# EAGLE schematic Conexión_Sensores (EAGLE 8.0.1)
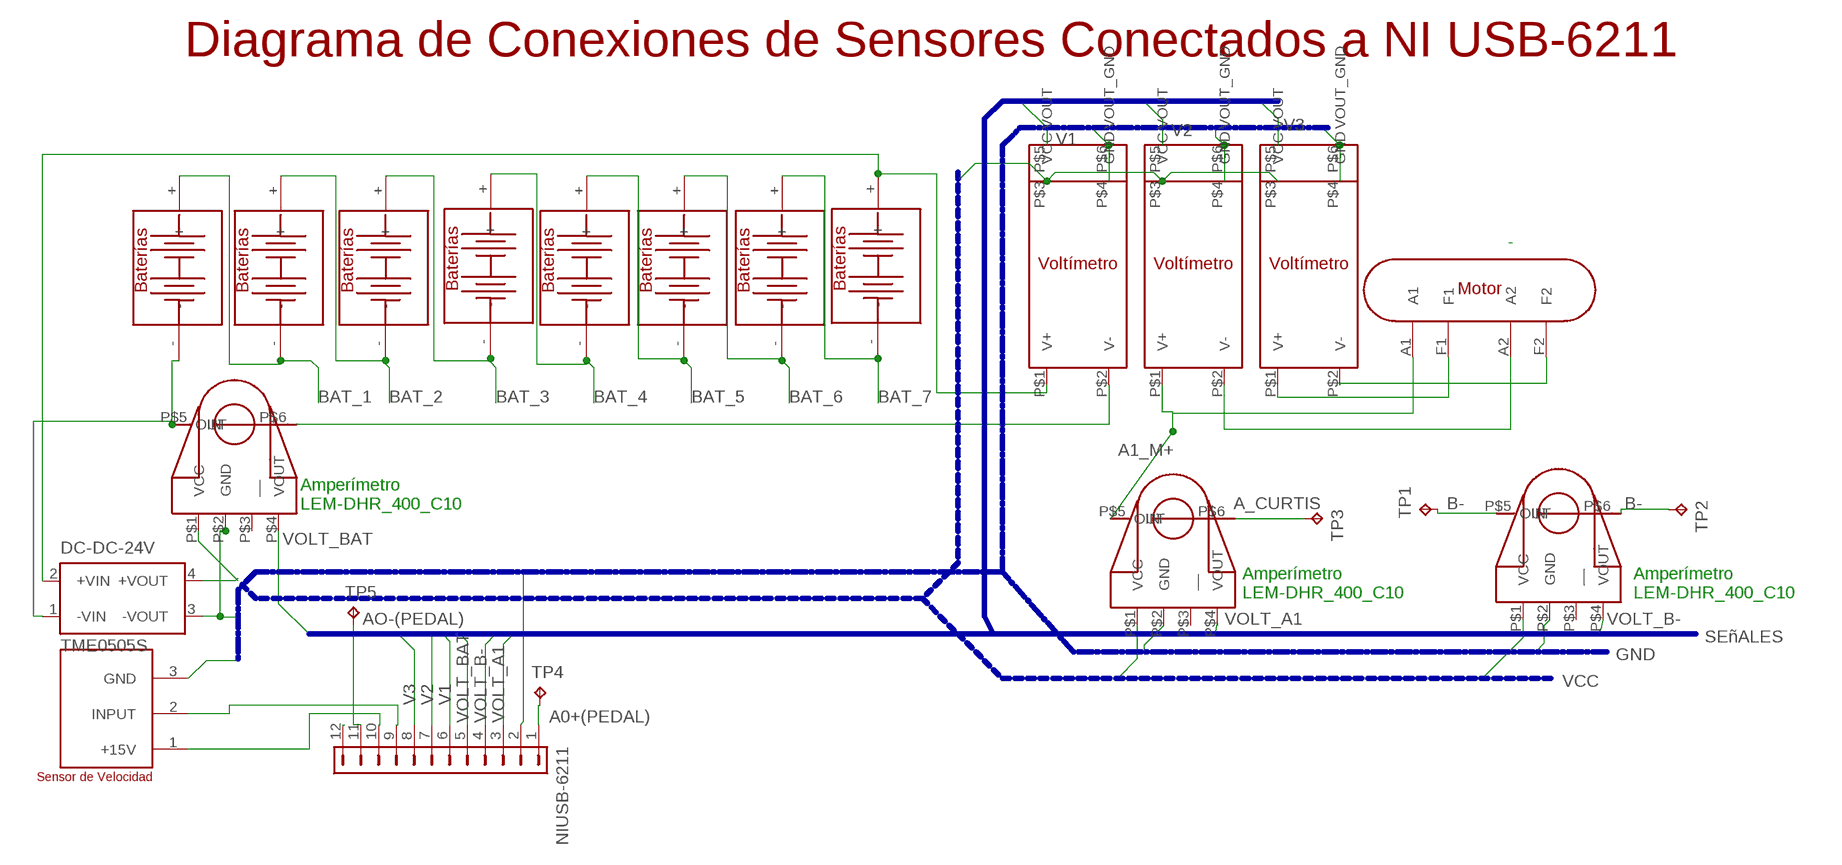
[diagram p0: schematic, sheet 1]

## Parts
AMPERIMETRO_1  AMPERIMETRO  [AMPERIMETRO]
AMPERIMETRO_2  AMPERIMETRO  [AMPERIMETRO]
DC-DC-24V  TME0505S  [TME]
NIUSB-6211  FH21-12S-1DSA  [FH21-12S-1DSA]
TP1  TPPAD1-13  [P1-13]
TP2  TPPAD1-13  [P1-13]
TP3  TPPAD1-13  [P1-13]
TP4  TPPAD1-13  [P1-13]
TP5  TPPAD1-13  [P1-13]
U$1  AMPERIMETRO  [AMPERIMETRO]
U$2  BATERIA  [BATERIA]
U$3  BATERIA  [BATERIA]
U$4  MOTOR_SENSORES  [MOTOR_SENSORES]
U$5  SENSOR_VELOCIDAD  [SENSOR_VEL]
U$6  BATERIA  [BATERIA]
U$7  BATERIA  [BATERIA]
U$8  BATERIA  [BATERIA]
U$9  BATERIA  [BATERIA]
U$10  BATERIA  [BATERIA]
U$11  BATERIA  [BATERIA]
V1  VOLTIMETRO  [VOLTIMETRO]
V2  VOLTIMETRO  [VOLTIMETRO]
V3  VOLTIMETRO  [VOLTIMETRO]

## Nets
A0+(PEDAL): NIUSB-6211.1 TP4.TP
A1_M+: AMPERIMETRO_1.P$5(IN) U$4.A1 V2.P$1(V+)
A_CURTIS: AMPERIMETRO_1.P$6(OUT) TP3.TP
AO-(PEDAL): NIUSB-6211.11 TP5.TP
B-: AMPERIMETRO_2.P$5(IN) AMPERIMETRO_2.P$6(OUT) TP1.TP TP2.TP
BAT_1: U$7.- U$8.+
BAT_2: U$6.- U$7.+
BAT_3: U$3.- U$6.+
BAT_4: U$3.+ U$9.-
BAT_5: U$2.- U$9.+
BAT_6: U$2.+ U$11.-
BAT_7: U$10.- U$11.+
GND: AMPERIMETRO_1.P$2(GND) AMPERIMETRO_2.P$2(GND) U$5.3(GND) V1.P$4(GND) V1.P$6(VOUT_GND) V2.P$4(GND) V2.P$6(VOUT_GND) V3.P$4(GND) V3.P$6(VOUT_GND)
N$1: DC-DC-24V.2(+VIN) U$10.+ V1.P$1(V+)
N$7: U$1.P$6(OUT) V1.P$2(V-)
N$9: DC-DC-24V.3(-VOUT) U$1.P$2(GND)
N$10: U$4.A2 V2.P$2(V-)
N$11: U$4.F1 V3.P$1(V+)
N$12: U$4.F2 V3.P$2(V-)
N$13: DC-DC-24V.1(-VIN) U$1.P$5(IN) U$8.-
N$14: NIUSB-6211.2
N$15: DC-DC-24V.4(+VOUT)
N$16: AMPERIMETRO_1.P$1(VCC)
N$19: V1.P$3(VCC) V2.P$3(VCC) V3.P$3(VCC)
N$22: NIUSB-6211.12
N$23: NIUSB-6211.10 U$5.1(+15V)
N$24: NIUSB-6211.9 U$5.2(INPUT)
V1: NIUSB-6211.6 V1.P$5(VOUT)
V2: NIUSB-6211.7 V2.P$5(VOUT)
V3: NIUSB-6211.8 V3.P$5(VOUT)
VCC: AMPERIMETRO_2.P$1(VCC) U$1.P$1(VCC)
VOLT_A1: AMPERIMETRO_1.P$4(VOUT) NIUSB-6211.3
VOLT_B-: AMPERIMETRO_2.P$4(VOUT) NIUSB-6211.4
VOLT_BAT: NIUSB-6211.5 U$1.P$4(VOUT)
Unconnected: AMPERIMETRO_1.P$3(__) AMPERIMETRO_2.P$3(__) U$1.P$3(__)

## Buses
SEñALES
GND
VCC

## Notes on the sheet
- Diagrama de Conexiones de Sensores Conectados a NI USB-6211
- Amperímetro 
  LEM-DHR_400_C10
- Amperímetro 
  LEM-DHR_400_C10
- Amperímetro 
  LEM-DHR_400_C10

## Library data of the parts
AMPERIMETRO_1 AMPERIMETRO_2 U$1 = ecar:AMPERIMETRO
DC-DC-24V = traco-electronic:TME?*: DC/DC Converter TME Series 1 Watt Source: www.tracopower.com .. tme.pdf; MPN: TME 0505S; OC_FARNELL: 1007538; OC_NEWARK: 51R5321
NIUSB-6211 = con-hirose:FH21-12S-1DSA: FPC CONNECTOR Source: con-hirose.lbr from Bob Starr <rtzaudio@mindspring.com>; OC_FARNELL: unknown; OC_NEWARK: unknown
TP1-TP5 = testpad:TP: Test pad
U$2 U$3 U$6-U$11 = ecar:BATERIA
U$4 = ecar:MOTOR_SENSORES
U$5 = ecar:SENSOR_VELOCIDAD
V1-V3 = ecar:VOLTIMETRO